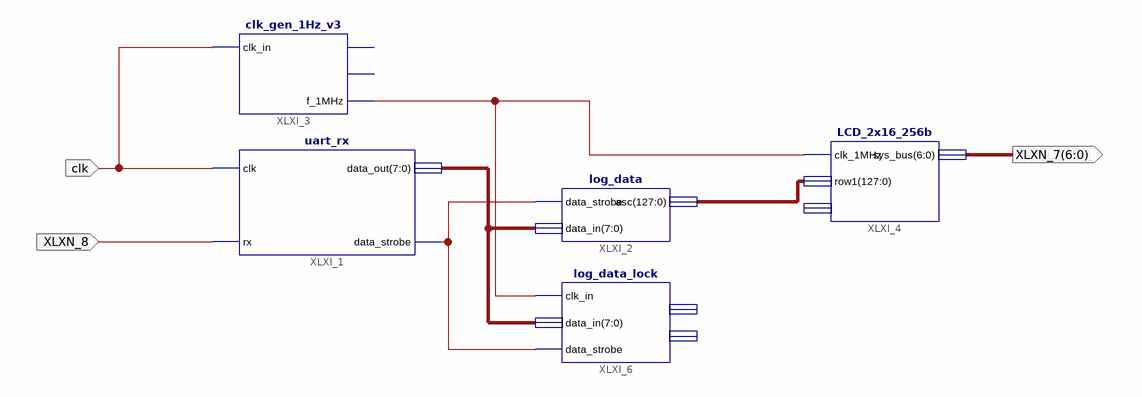
[diagram p0: schematic sheet 1]
// Xilinx ISE schematic top.sch (spartan3e) as structural Verilog: 5 symbols, 3 ports
module top (
  input  clk,
  input  XLXN_8,
  output [6:0] XLXN_7
);

  wire XLXN_2, XLXN_10;
  wire [7:0] XLXN_11;
  wire [127:0] XLXN_6;

  uart_rx XLXI_1 (.rx(XLXN_8), .clk(clk), .data_out(XLXN_11), .data_strobe(XLXN_2));
  log_data XLXI_2 (.data_strobe(XLXN_2), .data_in(XLXN_11), .asc(XLXN_6));
  clk_gen_1Hz_v3 XLXI_3 (.clk_in(clk), .f_1MHz(XLXN_10));  // open: f_1Hz, f_1kHz
  LCD_2x16_256b XLXI_4 (.clk_1MHz(XLXN_10), .row1(XLXN_6), .sys_bus(XLXN_7));  // open: row2
  log_data_lock XLXI_6 (.clk_in(XLXN_10), .data_strobe(XLXN_2), .data_in(XLXN_11));  // open: asc2, asc

  // Notes on the sheet:
  //   LOC on signal clk = B8
endmodule
